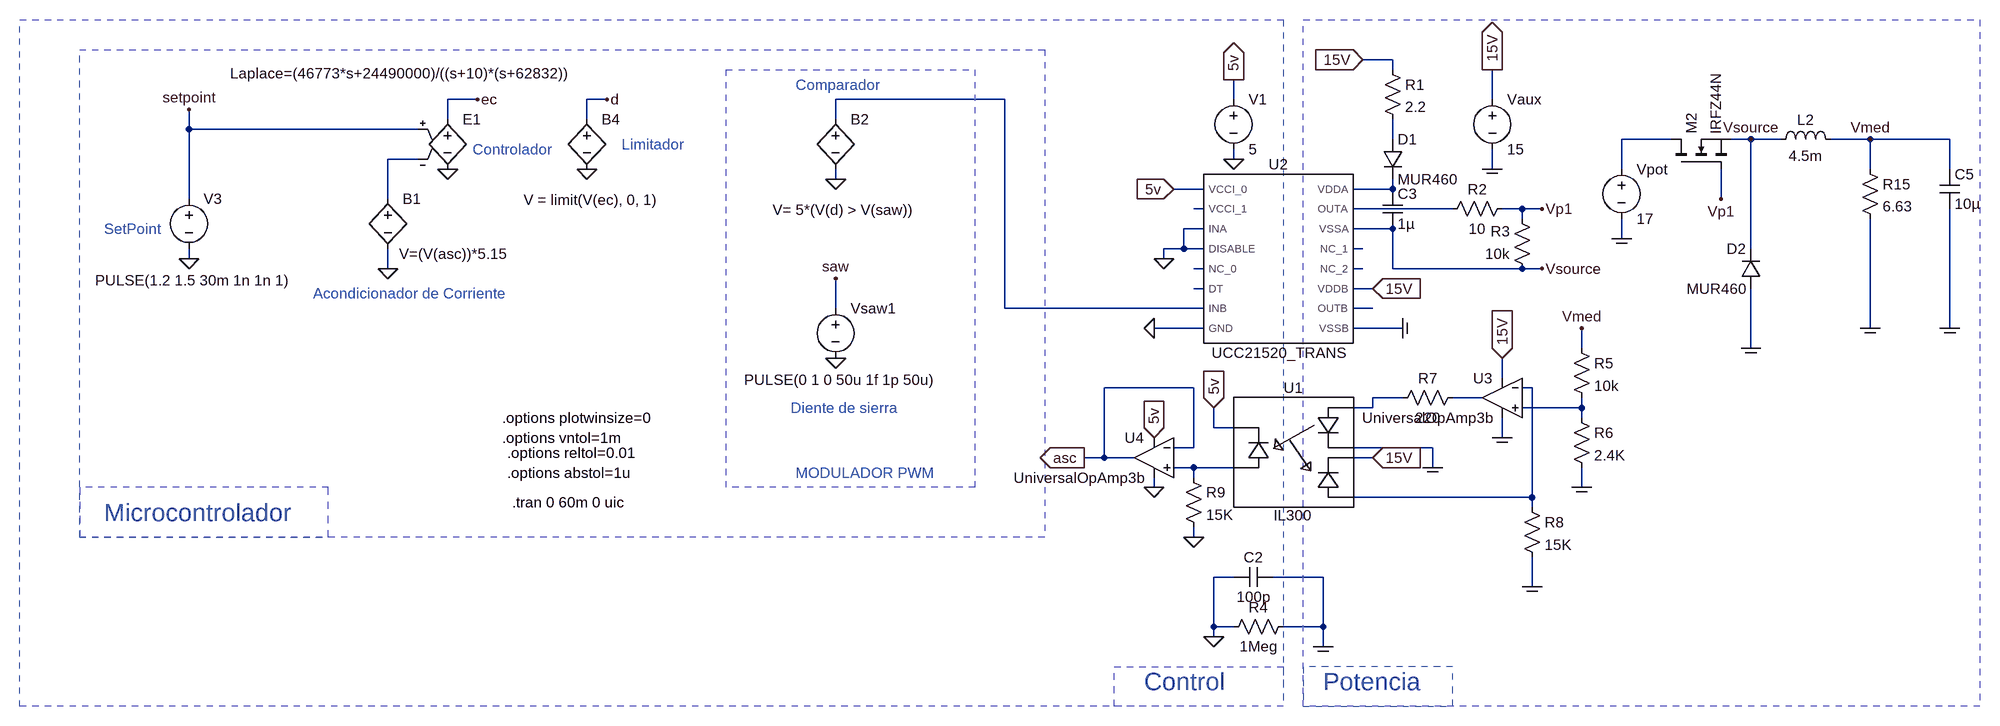
[diagram p0: schematic buckbooxt.asc]
buckbooxt.asc, the LTspice schematic file:
Version 4.1
SHEET 1 2132 1764
WIRE 1024 480 976 480
WIRE 1024 496 1024 480
WIRE -448 544 -496 544
WIRE -240 544 -272 544
WIRE 400 544 128 544
WIRE 768 544 768 512
WIRE 1184 544 1184 496
WIRE -496 576 -496 544
WIRE -272 576 -272 544
WIRE 128 576 128 544
WIRE -912 592 -912 560
WIRE -544 592 -912 592
WIRE 1024 608 1024 576
WIRE 1472 608 1392 608
WIRE 1600 608 1568 608
WIRE 1648 608 1600 608
WIRE 1792 608 1728 608
WIRE 1920 608 1792 608
WIRE -544 640 -592 640
WIRE 768 640 768 624
WIRE 1184 656 1184 624
WIRE 1392 656 1392 608
WIRE 1792 656 1792 608
WIRE 1920 656 1920 608
WIRE 128 672 128 656
WIRE 720 688 672 688
WIRE 1024 688 1024 672
WIRE 1024 688 960 688
WIRE -912 704 -912 592
WIRE -592 704 -592 640
WIRE 1552 704 1552 656
WIRE 720 720 704 720
WIRE 1120 720 960 720
WIRE 1232 720 1200 720
WIRE 1264 720 1232 720
WIRE 1232 736 1232 720
WIRE 720 752 688 752
WIRE 1024 752 960 752
WIRE 1392 768 1392 736
WIRE 688 784 688 752
WIRE 688 784 656 784
WIRE 720 784 688 784
WIRE 976 784 960 784
WIRE 1600 784 1600 608
WIRE -912 800 -912 784
WIRE 656 800 656 784
WIRE -592 816 -592 784
WIRE 720 816 704 816
WIRE 976 816 960 816
WIRE 1024 816 1024 752
WIRE 1232 816 1024 816
WIRE 1264 816 1232 816
WIRE 720 848 704 848
WIRE 992 848 960 848
WIRE 128 880 128 832
WIRE 400 880 400 544
WIRE 720 880 400 880
WIRE 992 880 960 880
WIRE 720 912 640 912
WIRE 1040 912 960 912
WIRE 1792 912 1792 736
WIRE 1920 912 1920 720
WIRE 1328 944 1328 912
WIRE 1600 944 1600 848
WIRE 1200 992 1200 960
WIRE 704 1008 560 1008
WIRE 1248 1008 1232 1008
WIRE 1040 1024 992 1024
WIRE 1168 1024 1120 1024
WIRE 992 1040 992 1024
WIRE 992 1040 960 1040
WIRE 1328 1040 1328 1024
WIRE 1328 1040 1232 1040
WIRE 1328 1056 1328 1040
WIRE 736 1072 736 1040
WIRE 768 1072 736 1072
WIRE 1200 1088 1200 1056
WIRE 704 1104 704 1008
WIRE 704 1104 672 1104
WIRE 1088 1104 960 1104
WIRE 560 1120 560 1008
WIRE 560 1120 528 1120
WIRE 608 1120 560 1120
WIRE 992 1120 960 1120
WIRE 704 1136 672 1136
WIRE 768 1136 704 1136
WIRE 1088 1136 1088 1104
WIRE 704 1152 704 1136
WIRE 640 1168 640 1152
WIRE 1328 1168 1328 1136
WIRE 1248 1184 1248 1008
WIRE 1248 1184 960 1184
WIRE 1248 1200 1248 1184
WIRE 704 1248 704 1232
WIRE 768 1312 736 1312
WIRE 912 1312 832 1312
WIRE 1248 1328 1248 1280
WIRE 736 1392 736 1312
WIRE 768 1392 736 1392
WIRE 912 1392 912 1312
WIRE 912 1392 848 1392
WIRE 736 1408 736 1392
WIRE 912 1424 912 1392
FLAG 768 640 0
FLAG 768 512 5v
IOPIN 768 512 Out
FLAG 1184 496 15V
IOPIN 1184 496 Out
FLAG 1184 656 COM
FLAG 736 1408 0
FLAG 672 688 5v
IOPIN 672 688 In
FLAG 976 480 15V
IOPIN 976 480 In
FLAG 1040 912 COM
FLAG 1600 944 COM
FLAG 1792 912 COM
FLAG 1920 912 COM
FLAG 1392 768 COM
FLAG 640 912 0
FLAG 992 848 15V
IOPIN 992 848 In
FLAG 656 800 0
FLAG 736 1040 5v
IOPIN 736 1040 In
FLAG 528 1120 asc
IOPIN 528 1120 Out
FLAG 128 960 0
FLAG 128 832 saw
FLAG -592 816 0
FLAG -912 800 0
FLAG -496 656 0
FLAG -240 544 d
FLAG -272 656 0
FLAG -448 544 ec
FLAG 128 672 0
FLAG 912 1424 COM
FLAG -912 560 setpoint
FLAG 1792 608 Vmed
FLAG 1552 704 Vp1
FLAG 1264 720 Vp1
FLAG 1600 608 Vsource
FLAG 1264 816 Vsource
FLAG 1328 912 Vmed
FLAG 992 1120 15V
IOPIN 992 1120 In
FLAG 704 1248 0
FLAG 640 1088 5v
IOPIN 640 1088 In
FLAG 640 1168 0
FLAG 1248 1328 COM
FLAG 1328 1168 COM
FLAG 1200 960 15V
IOPIN 1200 960 In
FLAG 1200 1088 COM
FLAG 1088 1136 COM
SYMBOL voltage 768 528 R0
SYMATTR InstName V1
SYMATTR Value 5
SYMBOL voltage 1184 528 R0
WINDOW 123 0 0 Left 0
WINDOW 39 0 0 Left 0
SYMATTR InstName Vaux
SYMATTR Value 15
SYMBOL cap 832 1296 R90
WINDOW 0 0 32 VBottom 2
WINDOW 3 32 32 VTop 2
SYMATTR InstName C2
SYMATTR Value 100p
SYMBOL res 864 1376 R90
WINDOW 0 0 56 VBottom 2
WINDOW 3 32 56 VTop 2
SYMATTR InstName R4
SYMATTR Value 1Meg
SYMBOL nmos 1472 656 R270
SYMATTR InstName M2
SYMATTR Value IRFZ44N
SYMBOL ind 1632 624 R270
WINDOW 0 32 56 VTop 2
WINDOW 3 5 56 VBottom 2
SYMATTR InstName L2
SYMATTR Value 4.5m
SYMATTR SpiceLine Rser=1m
SYMBOL voltage 1392 640 R0
WINDOW 123 0 0 Left 0
WINDOW 39 0 0 Left 0
SYMATTR InstName Vpot
SYMATTR Value 17
SYMBOL diode 1616 848 R180
WINDOW 0 24 64 Left 2
WINDOW 3 24 0 Left 2
SYMATTR InstName D2
SYMATTR Value MUR460
SYMBOL res 1776 640 R0
SYMATTR InstName R15
SYMATTR Value 6.63
SYMBOL cap 1904 656 R0
SYMATTR InstName C5
SYMATTR Value 10µ
SYMBOL bv -592 688 R0
WINDOW 3 18 104 Left 2
SYMATTR Value V=(V(asc))*5.15
SYMATTR InstName B1
SYMBOL voltage 128 864 R0
WINDOW 3 -147 131 Left 2
WINDOW 123 0 0 Left 0
WINDOW 39 0 0 Left 0
SYMATTR Value PULSE(0 1 0 50u 1f 1p 50u)
SYMATTR InstName Vsaw1
SYMBOL bv 128 560 R0
WINDOW 3 -101 161 Left 2
SYMATTR Value V= 5*(V(d) > V(saw))
SYMATTR InstName B2
SYMBOL voltage -912 688 R0
WINDOW 3 -151 147 Left 2
WINDOW 123 24 124 Left 2
WINDOW 39 0 0 Left 0
SYMATTR Value PULSE(1.2 1.5 30m 1n 1n 1)
SYMATTR InstName V3
SYMBOL e -496 560 R0
WINDOW 3 -350 -58 Left 2
SYMATTR Value Laplace=(46773*s+24490000)/((s+10)*(s+62832))
SYMATTR InstName E1
SYMBOL bv -272 560 R0
WINDOW 3 -102 145 Left 2
SYMATTR Value V = limit(V(ec), 0, 1)
SYMATTR InstName B4
SYMBOL UCC21520_TRANS 832 800 R0
SYMATTR InstName U2
SYMBOL res 1008 480 R0
SYMATTR InstName R1
SYMATTR Value 2.2
SYMBOL diode 1008 608 R0
SYMATTR InstName D1
SYMATTR Value MUR460
SYMBOL cap 1008 688 R0
SYMATTR InstName C3
SYMATTR Value 1µ
SYMBOL res 1216 704 R90
WINDOW 0 0 56 VBottom 2
WINDOW 3 32 56 VTop 2
SYMATTR InstName R2
SYMATTR Value 10
SYMBOL res 1248 832 R180
WINDOW 0 36 76 Left 2
WINDOW 3 36 40 Left 2
SYMATTR InstName R3
SYMATTR Value 10k
SYMBOL IL300 864 1104 M0
SYMATTR InstName U1
SYMBOL res 1312 928 R0
SYMATTR InstName R5
SYMATTR Value 10k
SYMBOL res 1312 1040 R0
SYMATTR InstName R6
SYMATTR Value 2.4K
SYMBOL OpAmps\\UniversalOpAmp3b 1200 1024 M0
SYMATTR InstName U3
SYMBOL res 1136 1008 R90
WINDOW 0 0 56 VBottom 2
WINDOW 3 32 56 VTop 2
SYMATTR InstName R7
SYMATTR Value 220
SYMBOL res 1232 1184 R0
SYMATTR InstName R8
SYMATTR Value 15K
SYMBOL OpAmps\\UniversalOpAmp3b 640 1120 M0
SYMATTR InstName U4
SYMBOL res 688 1136 R0
SYMATTR InstName R9
SYMATTR Value 15K
TEXT -392 1192 Left 2 !.tran 0 60m 0 uic
TEXT -400 1112 Left 2 !.options reltol=0.01
TEXT -400 1144 Left 2 !.options abstol=1u
TEXT -408 1088 Left 2 !.options vntol=1m
TEXT -408 1056 Left 2 !.options plotwinsize=0
TEXT 64 520 Left 2 ;Comparador
TEXT 56 1040 Left 2 ;Diente de sierra
TEXT -712 856 Left 2 ;Acondicionador de Corriente
TEXT -456 624 Left 2 ;Controlador
TEXT -216 616 Left 2 ;Limitador
TEXT 64 1144 Left 2 ;MODULADOR PWM
TEXT -1048 1208 Left 4 ;Microcontrolador
TEXT -1048 752 Left 2 ;SetPoint
TEXT 912 1480 Left 4 ;Potencia
TEXT 624 1480 Left 4 ;Control
RECTANGLE Normal 464 1248 -1088 464 2
RECTANGLE Normal -688 1168 -1088 1248 2
RECTANGLE Normal 848 1520 -1184 416 2
RECTANGLE Normal 1968 1520 880 416 2
RECTANGLE Normal 576 1456 848 1520 2
RECTANGLE Normal 1120 1456 880 1520 2
RECTANGLE Normal 352 1168 -48 496 2

The netlist it stands for:
* buckbooxt.asc
V1 5v 0 5
Vaux 15V COM 15
C2 COM 0 100p
R4 COM 0 1Meg
M2 N003 Vp1 Vsource Vsource IRFZ44N
L2 Vsource Vmed 4.5m Rser=1m
Vpot N003 COM 17
D2 COM Vsource MUR460
R15 Vmed COM 6.63
C5 Vmed COM 10µ
B1 N004 0 V=(V(asc))*5.15
Vsaw1 saw 0 PULSE(0 1 0 50u 1f 1p 50u)
B2 N001 0 V= 5*(V(d) > V(saw))
V3 setpoint 0 PULSE(1.2 1.5 30m 1n 1n 1)
E1 ec 0 setpoint N004 Laplace=(46773*s+24490000)/((s+10)*(s+62832))
B4 d 0 V = limit(V(ec), 0, 1)
X§U2 0 N011 0 0 N001 N007 N012 5v N006 N005 15V Vsource COM N009 N008 N010 UCC21520_TRANS  ; pins DISABLE DT GND INA INB OUTA OUTB VCCI_0 VCCI_1 VDDA VDDB VSSA VSSB NC_0 NC_1 NC_2
R1 15V N002 2.2
D1 N002 N005 MUR460
C3 N005 Vsource 1µ
R2 Vp1 N007 10
R3 Vsource Vp1 10k
X§U1 COM N014 15V N013 N017 5v IL300  ; pins LEDC LEDA PD1C PD1A PD2A PD2C
R5 Vmed N016 10k
R6 N016 COM 2.4K
* U3: UniversalOpAmp3b (symbol OpAmps\UniversalOpAmp3b not available, pins judged from their places): In+=N016 In-=N013 V+=15V V-=COM OUT=N015
R7 N015 N014 220
R8 N013 COM 15K
* U4: UniversalOpAmp3b (symbol OpAmps\UniversalOpAmp3b not available, pins judged from their places): In+=N017 In-=asc V+=5v V-=0 OUT=asc
R9 N017 0 15K
.model D D
.lib standard.dio
.model NMOS NMOS
.model PMOS PMOS
.lib standard.mos
.tran 0 60m 0 uic
.options reltol=0.01
.options abstol=1u
.options vntol=1m
.options plotwinsize=0
* Comparador
* Diente de sierra
* Acondicionador de Corriente
* Controlador
* Limitador
* MODULADOR PWM
* Microcontrolador
* SetPoint
* Potencia
* Control
.lib UCC21520_TRANS.lib
.lib IL300.SUB
.backanno
.end